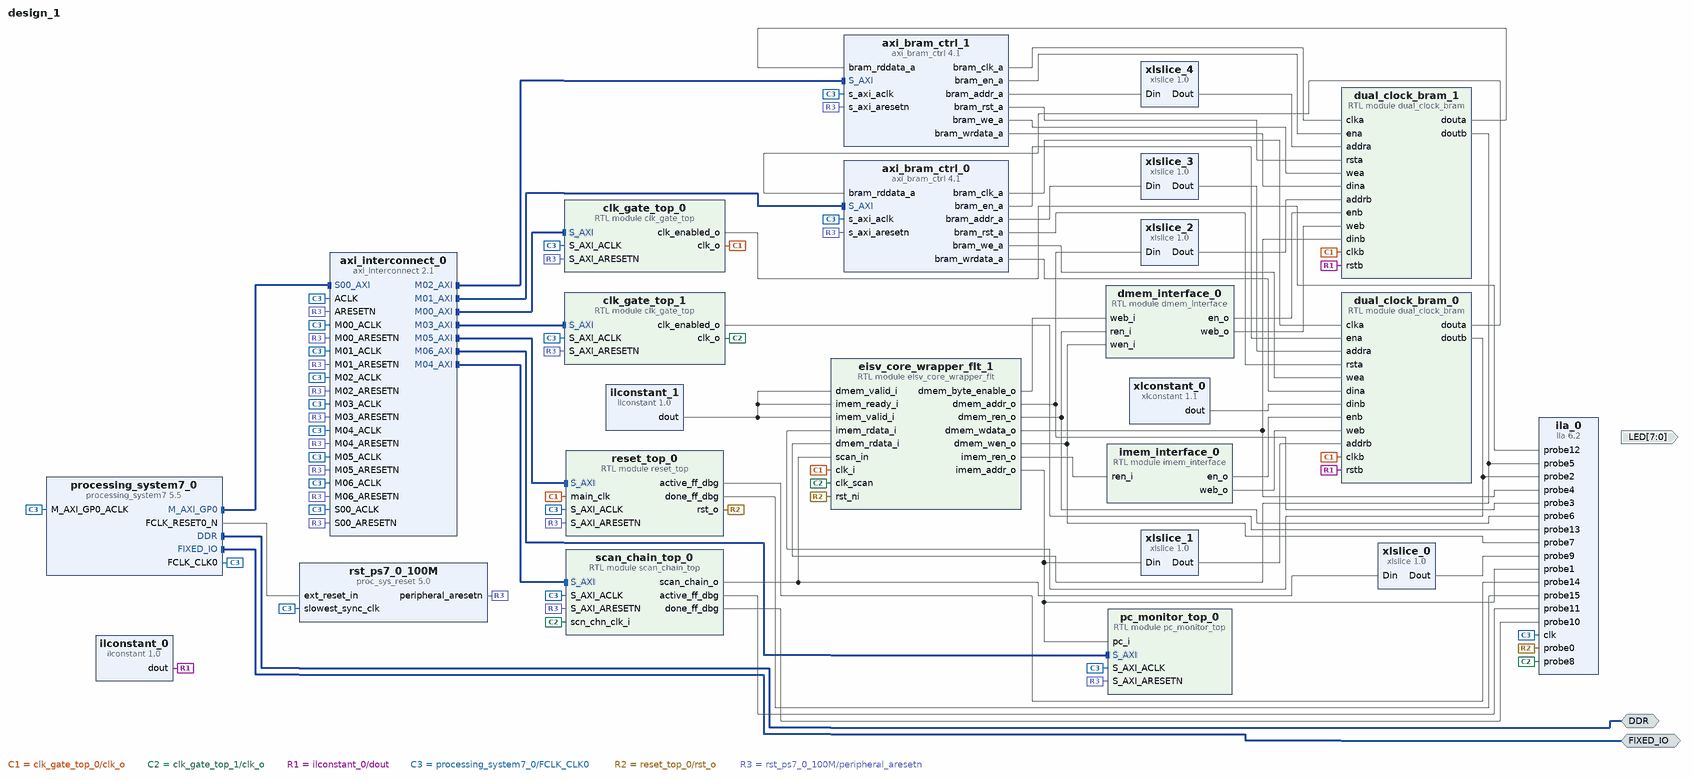
[diagram p0: block diagram of the top level]
# Vivado block design design_1, xc7z020clg484-1, Vivado 2024.2
create_bd_design design_1

create_bd_intf_port -mode Master -vlnv xilinx.com:interface:ddrx_rtl:1.0 DDR
create_bd_intf_port -mode Master -vlnv xilinx.com:display_processing_system7:fixedio_rtl:1.0 FIXED_IO
create_bd_port -dir O -from 7 -to 0 LED

create_bd_cell -type ip -vlnv xilinx.com:ip:processing_system7:5.5 processing_system7_0
set_property -dict [list \
  CONFIG.PCW_APU_PERIPHERAL_FREQMHZ 650 \
  CONFIG.PCW_ENET0_ENET0_IO {MIO 16 .. 27} \
  CONFIG.PCW_ENET0_GRP_MDIO_ENABLE 1 \
  CONFIG.PCW_ENET0_GRP_MDIO_IO EMIO \
  CONFIG.PCW_ENET0_PERIPHERAL_ENABLE 1 \
  CONFIG.PCW_ENET0_RESET_ENABLE 0 \
  CONFIG.PCW_ENET_RESET_ENABLE 1 \
  CONFIG.PCW_ENET_RESET_SELECT {Share reset pin} \
  CONFIG.PCW_FPGA0_PERIPHERAL_FREQMHZ 50 \
  CONFIG.PCW_FPGA1_PERIPHERAL_FREQMHZ 50 \
  CONFIG.PCW_GPIO_MIO_GPIO_ENABLE 1 \
  CONFIG.PCW_GPIO_MIO_GPIO_IO MIO \
  CONFIG.PCW_I2C_RESET_ENABLE 1 \
  CONFIG.PCW_PERIPHERAL_BOARD_PRESET part0 \
  CONFIG.PCW_PRESET_BANK1_VOLTAGE {LVCMOS 1.8V} \
  CONFIG.PCW_QSPI_GRP_FBCLK_ENABLE 1 \
  CONFIG.PCW_QSPI_GRP_FBCLK_IO {MIO 8} \
  CONFIG.PCW_QSPI_GRP_SINGLE_SS_ENABLE 1 \
  CONFIG.PCW_QSPI_GRP_SINGLE_SS_IO {MIO 1 .. 6} \
  CONFIG.PCW_QSPI_PERIPHERAL_ENABLE 1 \
  CONFIG.PCW_QSPI_QSPI_IO {MIO 1 .. 6} \
  CONFIG.PCW_SD0_GRP_CD_ENABLE 1 \
  CONFIG.PCW_SD0_GRP_CD_IO {MIO 47} \
  CONFIG.PCW_SD0_GRP_WP_ENABLE 1 \
  CONFIG.PCW_SD0_GRP_WP_IO EMIO \
  CONFIG.PCW_SD0_PERIPHERAL_ENABLE 1 \
  CONFIG.PCW_SD0_SD0_IO {MIO 40 .. 45} \
  CONFIG.PCW_SDIO_PERIPHERAL_FREQMHZ 50 \
  CONFIG.PCW_SINGLE_QSPI_DATA_MODE x4 \
  CONFIG.PCW_TTC0_PERIPHERAL_ENABLE 1 \
  CONFIG.PCW_TTC0_TTC0_IO EMIO \
  CONFIG.PCW_UART1_PERIPHERAL_ENABLE 1 \
  CONFIG.PCW_UART1_UART1_IO {MIO 48 .. 49} \
  CONFIG.PCW_UART_PERIPHERAL_FREQMHZ 100 \
  CONFIG.PCW_UIPARAM_DDR_FREQ_MHZ 525 \
  CONFIG.PCW_UIPARAM_DDR_PARTNO {MT41K128M16 JT-125} \
  CONFIG.PCW_USB0_PERIPHERAL_ENABLE 1 \
  CONFIG.PCW_USB0_RESET_ENABLE 1 \
  CONFIG.PCW_USB0_RESET_IO {MIO 46} \
  CONFIG.PCW_USB0_USB0_IO {MIO 28 .. 39} \
  CONFIG.PCW_USB_RESET_ENABLE 1 \
  CONFIG.PCW_USB_RESET_SELECT {Share reset pin} \
  CONFIG.preset None \
] [get_bd_cells processing_system7_0]
# 501 more settings of processing_system7_0 are not shown: defaults, MIO pin electricals, DDR timing, and values the tool derives
create_bd_cell -type ip -vlnv xilinx.com:ip:axi_interconnect:2.1 axi_interconnect_0
set_property -dict {CONFIG.NUM_MI 7 CONFIG.NUM_SI 1} [get_bd_cells axi_interconnect_0]
create_bd_cell -type ip -vlnv xilinx.com:ip:proc_sys_reset:5.0 rst_ps7_0_100M
create_bd_cell -type module -reference clk_gate_top clk_gate_top_0
set_property -dict {CONFIG.C_S_AXI_ADDR_WIDTH 6} [get_bd_cells clk_gate_top_0]
create_bd_cell -type ip -vlnv xilinx.com:ip:axi_bram_ctrl:4.1 axi_bram_ctrl_0
set_property -dict {CONFIG.SINGLE_PORT_BRAM 1} [get_bd_cells axi_bram_ctrl_0]
create_bd_cell -type ip -vlnv xilinx.com:ip:axi_bram_ctrl:4.1 axi_bram_ctrl_1
set_property -dict {CONFIG.SINGLE_PORT_BRAM 1} [get_bd_cells axi_bram_ctrl_1]
create_bd_cell -type module -reference imem_interface imem_interface_0
create_bd_cell -type module -reference dmem_interface dmem_interface_0
create_bd_cell -type module -reference clk_gate_top clk_gate_top_1
set_property -dict {CONFIG.C_S_AXI_ADDR_WIDTH 6} [get_bd_cells clk_gate_top_1]
create_bd_cell -type module -reference scan_chain_top scan_chain_top_0
set_property -dict {CONFIG.SCN_CHN_WIDTH 3} [get_bd_cells scan_chain_top_0]
create_bd_cell -type module -reference reset_top reset_top_0
set_property -dict {CONFIG.C_S_AXI_ADDR_WIDTH 5 CONFIG.C_S_AXI_DATA_WIDTH 32} [get_bd_cells reset_top_0]
create_bd_cell -type ip -vlnv xilinx.com:ip:xlconstant:1.1 xlconstant_0
set_property -dict {CONFIG.CONST_VAL 0 CONFIG.CONST_WIDTH 32} [get_bd_cells xlconstant_0]
create_bd_cell -type module -reference dual_clock_bram dual_clock_bram_0
set_property -dict {CONFIG.ADDR_WIDTH 10 CONFIG.DATA_BYTES 4} [get_bd_cells dual_clock_bram_0]
create_bd_cell -type inline_hdl -vlnv xilinx.com:inline_hdl:ilconstant:1.0 ilconstant_0
set_property -dict {CONFIG.CONST_VAL 0} [get_bd_cells ilconstant_0]
create_bd_cell -type module -reference dual_clock_bram dual_clock_bram_1
set_property -dict {CONFIG.ADDR_WIDTH 10 CONFIG.DATA_BYTES 4} [get_bd_cells dual_clock_bram_1]
create_bd_cell -type module -reference pc_monitor_top pc_monitor_top_0
create_bd_cell -type inline_hdl -vlnv xilinx.com:inline_hdl:ilconstant:1.0 ilconstant_1
set_property -dict {CONFIG.CONST_VAL 1} [get_bd_cells ilconstant_1]
create_bd_cell -type ip -vlnv xilinx.com:ip:ila:6.2 ila_0
set_property -dict [list \
  CONFIG.C_MONITOR_TYPE Native \
  CONFIG.C_NUM_OF_PROBES 16 \
  CONFIG.C_PROBE1_WIDTH 32 \
  CONFIG.C_PROBE2_WIDTH 32 \
  CONFIG.C_PROBE3_WIDTH 32 \
  CONFIG.C_PROBE4_WIDTH 32 \
  CONFIG.C_PROBE5_WIDTH 32 \
] [get_bd_cells ila_0]
create_bd_cell -type ip -vlnv xilinx.com:ip:xlslice:1.0 xlslice_0
set_property -dict {CONFIG.DIN_WIDTH 3} [get_bd_cells xlslice_0]
create_bd_cell -type ip -vlnv xilinx.com:ip:xlslice:1.0 xlslice_1
set_property -dict {CONFIG.DIN_FROM 11 CONFIG.DIN_TO 2} [get_bd_cells xlslice_1]
create_bd_cell -type ip -vlnv xilinx.com:ip:xlslice:1.0 xlslice_2
set_property -dict {CONFIG.DIN_FROM 11 CONFIG.DIN_TO 2} [get_bd_cells xlslice_2]
create_bd_cell -type ip -vlnv xilinx.com:ip:xlslice:1.0 xlslice_3
set_property -dict {CONFIG.DIN_FROM 11 CONFIG.DIN_TO 2 CONFIG.DIN_WIDTH 13} [get_bd_cells xlslice_3]
create_bd_cell -type ip -vlnv xilinx.com:ip:xlslice:1.0 xlslice_4
set_property -dict {CONFIG.DIN_FROM 11 CONFIG.DIN_TO 2 CONFIG.DIN_WIDTH 13} [get_bd_cells xlslice_4]
create_bd_cell -type module -reference eisv_core_wrapper_flt eisv_core_wrapper_flt_1

# ---- connections ----

connect_bd_intf_net [get_bd_intf_pins axi_interconnect_0/M00_AXI] [get_bd_intf_pins clk_gate_top_0/S_AXI]
connect_bd_intf_net [get_bd_intf_pins axi_interconnect_0/M01_AXI] [get_bd_intf_pins axi_bram_ctrl_0/S_AXI]
connect_bd_intf_net [get_bd_intf_pins axi_interconnect_0/M02_AXI] [get_bd_intf_pins axi_bram_ctrl_1/S_AXI]
connect_bd_intf_net [get_bd_intf_pins axi_interconnect_0/M03_AXI] [get_bd_intf_pins clk_gate_top_1/S_AXI]
connect_bd_intf_net [get_bd_intf_pins axi_interconnect_0/M04_AXI] [get_bd_intf_pins scan_chain_top_0/S_AXI]
connect_bd_intf_net [get_bd_intf_pins axi_interconnect_0/M05_AXI] [get_bd_intf_pins reset_top_0/S_AXI]
connect_bd_intf_net [get_bd_intf_pins pc_monitor_top_0/S_AXI] [get_bd_intf_pins axi_interconnect_0/M06_AXI]
connect_bd_intf_net [get_bd_intf_ports DDR] [get_bd_intf_pins processing_system7_0/DDR]
connect_bd_intf_net [get_bd_intf_ports FIXED_IO] [get_bd_intf_pins processing_system7_0/FIXED_IO]
connect_bd_intf_net [get_bd_intf_pins processing_system7_0/M_AXI_GP0] [get_bd_intf_pins axi_interconnect_0/S00_AXI]
connect_bd_net [get_bd_pins axi_bram_ctrl_0/bram_addr_a] [get_bd_pins xlslice_3/Din]
connect_bd_net [get_bd_pins axi_bram_ctrl_0/bram_clk_a] [get_bd_pins dual_clock_bram_0/clka]
connect_bd_net [get_bd_pins axi_bram_ctrl_0/bram_en_a] [get_bd_pins dual_clock_bram_0/ena]
connect_bd_net [get_bd_pins axi_bram_ctrl_0/bram_rst_a] [get_bd_pins dual_clock_bram_0/rsta]
connect_bd_net [get_bd_pins axi_bram_ctrl_0/bram_we_a] [get_bd_pins dual_clock_bram_0/wea]
connect_bd_net [get_bd_pins axi_bram_ctrl_0/bram_wrdata_a] [get_bd_pins dual_clock_bram_0/dina]
connect_bd_net [get_bd_pins axi_bram_ctrl_1/bram_addr_a] [get_bd_pins xlslice_4/Din]
connect_bd_net [get_bd_pins axi_bram_ctrl_1/bram_clk_a] [get_bd_pins dual_clock_bram_1/clka]
connect_bd_net [get_bd_pins axi_bram_ctrl_1/bram_en_a] [get_bd_pins dual_clock_bram_1/ena]
connect_bd_net [get_bd_pins axi_bram_ctrl_1/bram_rst_a] [get_bd_pins dual_clock_bram_1/rsta]
connect_bd_net [get_bd_pins axi_bram_ctrl_1/bram_we_a] [get_bd_pins dual_clock_bram_1/wea]
connect_bd_net [get_bd_pins axi_bram_ctrl_1/bram_wrdata_a] [get_bd_pins dual_clock_bram_1/dina]
connect_bd_net [get_bd_pins clk_gate_top_0/clk_enabled_o] [get_bd_pins ila_0/probe12]
connect_bd_net [get_bd_pins clk_gate_top_0/clk_o] \
  [get_bd_pins dual_clock_bram_0/clkb] [get_bd_pins dual_clock_bram_1/clkb] [get_bd_pins reset_top_0/main_clk] \
  [get_bd_pins eisv_core_wrapper_flt_1/clk_i]
connect_bd_net [get_bd_pins clk_gate_top_1/clk_enabled_o] [get_bd_pins ila_0/probe13]
connect_bd_net [get_bd_pins clk_gate_top_1/clk_o] \
  [get_bd_pins ila_0/probe8] [get_bd_pins scan_chain_top_0/scn_chn_clk_i] [get_bd_pins eisv_core_wrapper_flt_1/clk_scan]
connect_bd_net [get_bd_pins dmem_interface_0/en_o] [get_bd_pins dual_clock_bram_1/enb]
connect_bd_net [get_bd_pins dmem_interface_0/web_o] [get_bd_pins dual_clock_bram_1/web]
connect_bd_net [get_bd_pins dual_clock_bram_0/douta] [get_bd_pins axi_bram_ctrl_0/bram_rddata_a]
connect_bd_net [get_bd_pins dual_clock_bram_0/doutb] [get_bd_pins ila_0/probe2] [get_bd_pins eisv_core_wrapper_flt_1/imem_rdata_i]
connect_bd_net [get_bd_pins dual_clock_bram_1/douta] [get_bd_pins axi_bram_ctrl_1/bram_rddata_a]
connect_bd_net [get_bd_pins dual_clock_bram_1/doutb] [get_bd_pins ila_0/probe5] [get_bd_pins eisv_core_wrapper_flt_1/dmem_rdata_i]
connect_bd_net [get_bd_pins eisv_core_wrapper_flt_1/dmem_addr_o] [get_bd_pins xlslice_2/Din] [get_bd_pins ila_0/probe3]
connect_bd_net [get_bd_pins eisv_core_wrapper_flt_1/dmem_byte_enable_o] [get_bd_pins dmem_interface_0/web_i]
connect_bd_net [get_bd_pins eisv_core_wrapper_flt_1/dmem_ren_o] [get_bd_pins ila_0/probe6] [get_bd_pins dmem_interface_0/ren_i]
connect_bd_net [get_bd_pins eisv_core_wrapper_flt_1/dmem_wdata_o] [get_bd_pins ila_0/probe4] [get_bd_pins dual_clock_bram_1/dinb]
connect_bd_net [get_bd_pins eisv_core_wrapper_flt_1/dmem_wen_o] [get_bd_pins ila_0/probe7] [get_bd_pins dmem_interface_0/wen_i]
connect_bd_net [get_bd_pins eisv_core_wrapper_flt_1/imem_addr_o] \
  [get_bd_pins xlslice_1/Din] [get_bd_pins ila_0/probe1] [get_bd_pins pc_monitor_top_0/pc_i]
connect_bd_net [get_bd_pins eisv_core_wrapper_flt_1/imem_ren_o] [get_bd_pins imem_interface_0/ren_i]
connect_bd_net [get_bd_pins ilconstant_0/dout] [get_bd_pins dual_clock_bram_0/rstb] [get_bd_pins dual_clock_bram_1/rstb]
connect_bd_net [get_bd_pins ilconstant_1/dout] \
  [get_bd_pins eisv_core_wrapper_flt_1/imem_ready_i] [get_bd_pins eisv_core_wrapper_flt_1/imem_valid_i] \
  [get_bd_pins eisv_core_wrapper_flt_1/dmem_valid_i]
connect_bd_net [get_bd_pins imem_interface_0/en_o] [get_bd_pins dual_clock_bram_0/enb]
connect_bd_net [get_bd_pins imem_interface_0/web_o] [get_bd_pins dual_clock_bram_0/web]
connect_bd_net [get_bd_pins processing_system7_0/FCLK_CLK0] \
  [get_bd_pins processing_system7_0/M_AXI_GP0_ACLK] [get_bd_pins rst_ps7_0_100M/slowest_sync_clk] \
  [get_bd_pins axi_bram_ctrl_0/s_axi_aclk] [get_bd_pins axi_bram_ctrl_1/s_axi_aclk] [get_bd_pins axi_interconnect_0/ACLK] \
  [get_bd_pins axi_interconnect_0/S00_ACLK] [get_bd_pins axi_interconnect_0/M00_ACLK] \
  [get_bd_pins axi_interconnect_0/M01_ACLK] [get_bd_pins axi_interconnect_0/M02_ACLK] \
  [get_bd_pins axi_interconnect_0/M03_ACLK] [get_bd_pins axi_interconnect_0/M04_ACLK] \
  [get_bd_pins axi_interconnect_0/M05_ACLK] [get_bd_pins axi_interconnect_0/M06_ACLK] [get_bd_pins ila_0/clk] \
  [get_bd_pins clk_gate_top_0/S_AXI_ACLK] [get_bd_pins clk_gate_top_1/S_AXI_ACLK] [get_bd_pins pc_monitor_top_0/S_AXI_ACLK] \
  [get_bd_pins reset_top_0/S_AXI_ACLK] [get_bd_pins scan_chain_top_0/S_AXI_ACLK]
connect_bd_net [get_bd_pins processing_system7_0/FCLK_RESET0_N] [get_bd_pins rst_ps7_0_100M/ext_reset_in]
connect_bd_net [get_bd_pins reset_top_0/active_ff_dbg] [get_bd_pins ila_0/probe14]
connect_bd_net [get_bd_pins reset_top_0/done_ff_dbg] [get_bd_pins ila_0/probe15]
connect_bd_net [get_bd_pins reset_top_0/rst_o] [get_bd_pins ila_0/probe0] [get_bd_pins eisv_core_wrapper_flt_1/rst_ni]
connect_bd_net [get_bd_pins rst_ps7_0_100M/peripheral_aresetn] \
  [get_bd_pins axi_bram_ctrl_0/s_axi_aresetn] [get_bd_pins axi_bram_ctrl_1/s_axi_aresetn] \
  [get_bd_pins axi_interconnect_0/ARESETN] [get_bd_pins axi_interconnect_0/S00_ARESETN] \
  [get_bd_pins axi_interconnect_0/M00_ARESETN] [get_bd_pins axi_interconnect_0/M01_ARESETN] \
  [get_bd_pins axi_interconnect_0/M02_ARESETN] [get_bd_pins axi_interconnect_0/M03_ARESETN] \
  [get_bd_pins axi_interconnect_0/M04_ARESETN] [get_bd_pins axi_interconnect_0/M05_ARESETN] \
  [get_bd_pins axi_interconnect_0/M06_ARESETN] [get_bd_pins clk_gate_top_0/S_AXI_ARESETN] \
  [get_bd_pins clk_gate_top_1/S_AXI_ARESETN] [get_bd_pins pc_monitor_top_0/S_AXI_ARESETN] \
  [get_bd_pins reset_top_0/S_AXI_ARESETN] [get_bd_pins scan_chain_top_0/S_AXI_ARESETN]
connect_bd_net [get_bd_pins scan_chain_top_0/active_ff_dbg] [get_bd_pins ila_0/probe11]
connect_bd_net [get_bd_pins scan_chain_top_0/done_ff_dbg] [get_bd_pins ila_0/probe10]
connect_bd_net [get_bd_pins scan_chain_top_0/scan_chain_o] [get_bd_pins xlslice_0/Din] [get_bd_pins eisv_core_wrapper_flt_1/scan_in]
connect_bd_net [get_bd_pins xlconstant_0/dout] [get_bd_pins dual_clock_bram_0/dinb]
connect_bd_net [get_bd_pins xlslice_0/Dout] [get_bd_pins ila_0/probe9]
connect_bd_net [get_bd_pins xlslice_1/Dout] [get_bd_pins dual_clock_bram_0/addrb]
connect_bd_net [get_bd_pins xlslice_2/Dout] [get_bd_pins dual_clock_bram_1/addrb]
connect_bd_net [get_bd_pins xlslice_3/Dout] [get_bd_pins dual_clock_bram_0/addra]
connect_bd_net [get_bd_pins xlslice_4/Dout] [get_bd_pins dual_clock_bram_1/addra]
set_property HDL_ATTRIBUTE.BMM_INFO_PROCESSOR {arm > design_1 axi_bram_ctrl_0 design_1 axi_bram_ctrl_1} [get_bd_cells processing_system7_0]
set_property HDL_ATTRIBUTE.KEEP_HIERARCHY yes [get_bd_cells processing_system7_0]
set_property HDL_ATTRIBUTE.BMM_INFO_ADDRESS_SPACE {byte  0x42000000 32 > design_1 axi_bram_ctrl_0_bram} [get_bd_cells axi_bram_ctrl_0]
set_property HDL_ATTRIBUTE.KEEP_HIERARCHY yes [get_bd_cells axi_bram_ctrl_0]
set_property HDL_ATTRIBUTE.BMM_INFO_ADDRESS_SPACE {byte  0x44000000 32 > design_1 axi_bram_ctrl_1_bram} [get_bd_cells axi_bram_ctrl_1]
set_property HDL_ATTRIBUTE.KEEP_HIERARCHY yes [get_bd_cells axi_bram_ctrl_1]

# ---- address map ----
assign_bd_address -offset 0x40000000 -range 4K -target_address_space [get_bd_addr_spaces processing_system7_0/Data] [get_bd_addr_segs clk_gate_top_0/S_AXI/reg0]
assign_bd_address -offset 0x40001000 -range 4K -target_address_space [get_bd_addr_spaces processing_system7_0/Data] [get_bd_addr_segs clk_gate_top_1/S_AXI/reg0]
assign_bd_address -offset 0x40002000 -range 4K -target_address_space [get_bd_addr_spaces processing_system7_0/Data] [get_bd_addr_segs scan_chain_top_0/S_AXI/reg0]
assign_bd_address -offset 0x40003000 -range 4K -target_address_space [get_bd_addr_spaces processing_system7_0/Data] [get_bd_addr_segs reset_top_0/S_AXI/reg0]
assign_bd_address -offset 0x40004000 -range 4K -target_address_space [get_bd_addr_spaces processing_system7_0/Data] [get_bd_addr_segs pc_monitor_top_0/S_AXI/reg0]
assign_bd_address -offset 0x42000000 -range 8K -target_address_space [get_bd_addr_spaces processing_system7_0/Data] [get_bd_addr_segs axi_bram_ctrl_0/S_AXI/Mem0]
assign_bd_address -offset 0x44000000 -range 8K -target_address_space [get_bd_addr_spaces processing_system7_0/Data] [get_bd_addr_segs axi_bram_ctrl_1/S_AXI/Mem0]

validate_bd_design
save_bd_design
